# Altium schematic sheet Arduino_4_Layer.SchDoc
size A
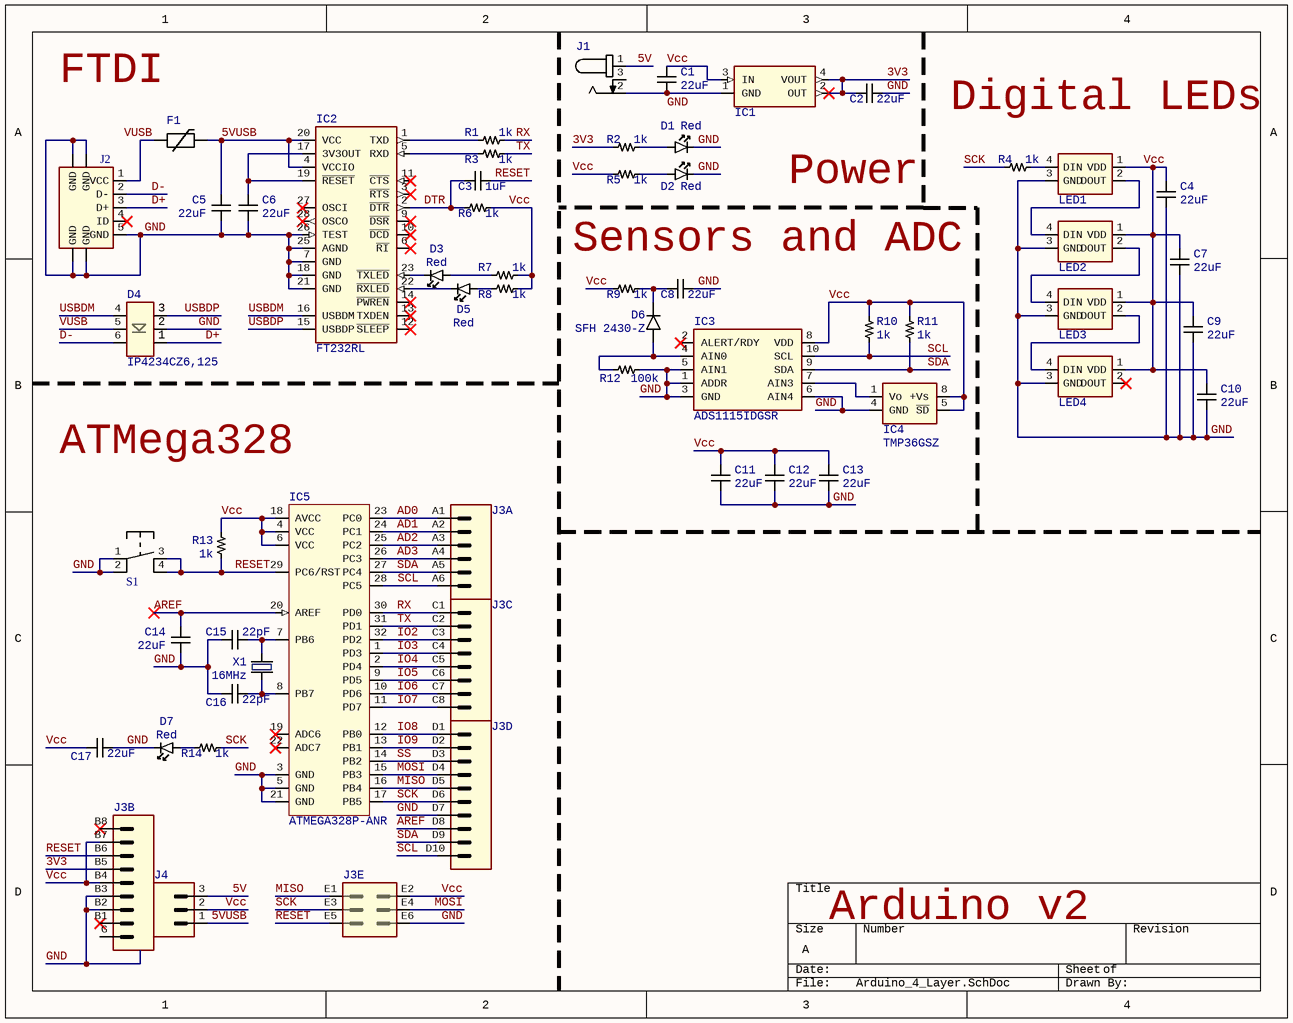
[diagram p0: Arduino_4_Layer.SchDoc]

## Parts
C1  22uF  [CAP1206]
C2  22uF  [CAP1206]
C3  1uF  [CAP1206]
C4  22uF  [CAP1206]
C5  22uF  [CAP1206]
C6  22uF  [CAP1206]
C7  22uF  [CAP1206]
C8  22uF  [CAP1206]
C9  22uF  [CAP1206]
C10  22uF  [CAP1206]
C11  22uF  [CAP1206]
C12  22uF  [CAP1206]
C13  22uF  [CAP1206]
C14  22uF  [CAP1206]
C15  22pF  [CAP1206]
C16  22pF  [CAP1206]
C17  22uF  [CAP1206]
D1  Red  [LED]
D2  Red  [LED]
D3  Red  [LED]
D4  IP4234CZ6,125  [TSOP-6]
D5  Red  [LED]
D6  SFH 2430-Z  [SFH 2430]
D7  Red  [LED]
F1  MF-MSMF050-2  [FUSE]  (value not drawn)
IC1  AZ1117CH-3.3TRG1  [SOT223]  (value not drawn)
IC2  FT232RL  [SOP65P780X200-28N]
IC3  ADS1115IDGSR  [VSSOP-10]
IC4  TMP36GSZ  [SOIC-8]
IC5  ATMEGA328P-ANR  [TQFP-32]
J1  Power Jack  [Power_Jack]  (value not drawn)
J2  XM7D-0512  [XM7D-0512]  (value not drawn)
J3  Arduino_Shield  [ARDUINO_SHIELD]  (value not drawn)  (parts A,B,C,D,E of 5)
J4  PREC003SAAN-RC  [3_PIN]  (value not drawn)
LED1  IN-PI55QATPRPGPBPW-60  [PLCC_5x5]  (value not drawn)
LED2  IN-PI55QATPRPGPBPW-60  [PLCC_5x5]  (value not drawn)
LED3  IN-PI55QATPRPGPBPW-60  [PLCC_5x5]  (value not drawn)
LED4  IN-PI55QATPRPGPBPW-60  [PLCC_5x5]  (value not drawn)
R1  1k  [RES1206]
R2  1k  [RES1206]
R3  1k  [RES1206]
R4  1k  [RES1206]
R5  1k  [RES1206]
R6  1k  [RES1206]
R7  1k  [RES1206]
R8  1k  [RES1206]
R9  1k  [RES1206]
R10  1k  [RES1206]
R11  1k  [RES1206]
R12  100k  [RES1206]
R13  1k  [RES1206]
R14  1k  [RES1206]
S1  TL3305AF160QG  [Switch]  (value not drawn)
X1  16MHz  [Crystal]

## Nets
3V3: C2.2 IC1.2(OUT) IC1.4(VOUT) J3.B5 R2.2
5V: J1.1 J4.3
5VUSB: C5.2 F1.2 IC2.4(VCCIO) IC2.20(VCC) J4.1
AD0: IC5.23(PC0) J3.A1
AD1: IC5.24(PC1) J3.A2
AD2: IC5.25(PC2) J3.A3
AD3: IC5.26(PC3) J3.A4
AREF: C14.2 IC5.20(AREF) J3.D8
D+: D4.1 J2.3(D+)
D-: D4.6 J2.2(D-)
DTR: C3.1 IC2.2(~{DTR}) R6.1
GND: C1.2 C2.1 C4.1 C5.1 C6.1 C7.1 C8.2 C9.1 C10.1 C11.1 C12.1 C13.1 C14.1 C15.1 C16.1 C17.1 D1.1 D2.1 D4.2 D7.1 IC1.1(GND) IC2.7(GND) IC2.18(GND) IC2.21(GND) IC2.25(AGND) IC2.26(TEST) IC3.1(ADDR) IC3.3(GND) IC3.5(AIN1) IC3.6(AIN4) IC4.4(GND) IC5.3(GND) IC5.5(GND) IC5.21(GND) J1.2 J2.5(GND) J2.SH1(GND) J2.SH2(GND) J2.SH3(GND) J2.SH4(GND) J3.B2 J3.B3 J3.D7 J3.E6 LED1.3(GND) LED2.3(GND) LED3.3(GND) LED4.3(GND) R12.1 S1.1 S1.2
IO2: IC5.32(PD2) J3.C3
IO3: IC5.1(PD3) J3.C4
IO4: IC5.2(PD4) J3.C5
IO5: IC5.9(PD5) J3.C6
IO6: IC5.10(PD6) J3.C7
IO7: IC5.11(PD7) J3.C8
IO8: IC5.12(PB0) J3.D1
IO9: IC5.13(PB1) J3.D2
MISO: IC5.16(PB4) J3.D5 J3.E1
MOSI: IC5.15(PB3) J3.D4 J3.E4
RESET: C3.2 IC5.29(PC6/RST) J3.B6 J3.E5 R13.1 S1.3 S1.4
RX: IC5.30(PD0) J3.C1 R1.2
SCK: IC5.17(PB5) J3.D6 J3.E3 R4.1 R14.2
SCL: IC3.10(SCL) IC5.28(PC5) J3.A6 J3.D10 R10.1
SDA: IC3.9(SDA) IC5.27(PC4) J3.A5 J3.D9 R11.1
SS: IC5.14(PB2) J3.D3
TX: IC5.31(PD1) J3.C2 R3.2
USBDM: D4.4 IC2.16(USBDM)
USBDP: D4.3 IC2.15(USBDP)
Vcc: C1.1 C4.2 C7.2 C9.2 C10.2 C11.2 C12.2 C13.2 C17.2 IC1.3(IN) IC3.8(VDD) IC4.5(~{SD}) IC4.8(+Vs) IC5.4(VCC) IC5.6(VCC) IC5.18(AVCC) J3.B4 J3.B7 J3.E2 J4.2 LED1.1(VDD) LED2.1(VDD) LED3.1(VDD) LED4.1(VDD) R5.2 R6.2 R7.2 R8.2 R9.2 R10.2 R11.2 R13.2
VUSB: D4.5 F1.1 J2.1(VCC)
NetC6_2: C6.2 IC2.17(3V3OUT) IC2.19(~{RESET})
NetC8_1: C8.1 D6.C R9.1
NetC15_2: C15.2 IC5.7(PB6) X1.2
NetC16_2: C16.2 IC5.8(PB7) X1.1
NetD1_2: D1.2 R2.1
NetD2_2: D2.2 R5.1
NetD3_1: D3.1 IC2.23(~{TXLED})
NetD3_2: D3.2 R7.1
NetD5_1: D5.1 IC2.22(~{RXLED})
NetD5_2: D5.2 R8.1
NetD6_A: D6.A IC3.4(AIN0) R12.2
NetD7_2: D7.2 R14.1
NetIC2_1: IC2.1(TXD) R1.1
NetIC2_5: IC2.5(RXD) R3.1
NetIC3_7: IC3.7(AIN3) IC4.1(Vo)
NetLED1_2: LED1.2(DOUT) LED2.4(DIN)
NetLED1_4: LED1.4(DIN) R4.2
NetLED2_2: LED2.2(DOUT) LED3.4(DIN)
NetLED3_2: LED3.2(DOUT) LED4.4(DIN)

Not connected (* = marked no-connect by the designer): IC2 3(~{RTS})* 6(~{RI})* 9(~{DSR})* 10(~{DCD})* 11(~{CTS})* 12(~{SLEEP})* 13(TXDEN)* 14(~{PWREN})* 27(OSCI)* 28(OSCO)*; IC3 2(ALERT/RDY)*; IC5 19(ADC6)* 22(ADC7)*; J1 3; J2 4(ID)*; J3 B1(1)* B8(8)* G(GND); LED4 2(DOUT)*

## Notes on the sheet
- FTDI
- Digital LEDs
- Power
- Sensors and ADC
- ATMega328
- Arduino v2

## Library data of the parts
C1 C2 C4-C14 C17 = 1206_22uF: 22µF ±20% 16V Ceramic Capacitor X5R 1206 (3216 Metric); Value: CAP CER 22UF 16V X5R 1206; Digikey Link: https://www.digikey.com/product-detail/en/CL31A226MOCLNNC/1276-2728-1-ND/3890814/?itemSeq=304982363; Digikey Part: 1276-2728-1-ND
C3 = 1206_1uF: 1µF ±20% 16V Ceramic Capacitor X7R 1206 (3216 Metric); Value: CAP CER 1UF 16V X7R 1206; Digikey Link: https://www.digikey.com/product-detail/en/C1206C105M4RACTU/399-8150-1-ND/3471873/?itemSeq=304982366; Digikey Part: 399-8150-1-ND
C15 C16 = 1206_22pF: 22pF ±5% 16V Ceramic Capacitor C0G, NP0 1206 (3216 Metric); Value: CAP CER 22PF 16V C0G/NP0 1206; Digikey Link: https://www.digikey.com/product-detail/en/885012008011/732-7867-1-ND/5454494/?itemSeq=304982362; Digikey Part: 732-7867-1-ND
D1-D3 D5 D7 = 1206_RED_LED: Red 638nm LED Indication - Discrete 1.8V 1206 (3216 Metric); Value: LED RED CLEAR 1206 SMD; Digikey Link: https://www.digikey.com/product-detail/en/LTST-C150CKT/160-1167-1-ND/269239/?itemSeq=304982368; Digikey Part: 160-1167-1-ND
D4 = TVS_Diode: Clamp Ipp Tvs Diode Surface Mount 6-TSOP; Value: TVS DIODE 5.5V 6TSOP; Digikey Part: 1727-4717-1-ND; Digikey Link: https://www.digikey.com/product-detail/en/IP4234CZ6%2c125/1727-4717-1-ND/2531156/?itemSeq=304982369
D6 = SFH 2430-Z: Ambient Light Sensor Photodiode Chip 570nm 0.17A/W Sensitivity Automotive 2-Pin DIL SMT; Manufacturer: Osram Opto; Rise Time: 200us; Dark Current: 100pA; Forward Voltage: 1.2V; Viewing Angle: 120°; Forward Current: 100mA; Reverse Voltage (DC): 6V; Max Power Dissipation: 150mW; Diode Type: PIN; Supplier 1: Digi-Key; Manufacturer Part Number: SFH 2430-Z; Stock 1: 19614; Pricing 1: 1=1.86000, 10=1.51200, 100=0.93020, 500=0.79066 (USD); Mount: Surface Mount; Case/Package: SMD/SMT; Number of Pins: 2; Min Operating Temperature: -40°C; Max Operating Temperature: 100°C; Wavelength: 570nm; Fall Time: 200us; Package Quantity: 1500; Packaging: Tape and Reel; Response Time: 200us; Max Reverse Voltage (DC): 6V; Length: 4.5mm; Height: 1.2mm; Width: 4mm; Radiation Hardening: No; ComponentLink1URL: https://datasheet.ciiva.com/1249/00049208-0-1249200.pdf?src-supplier=Avnet; ComponentLink1Description: https://datasheet.ciiva.com/1249/00049208-0-1249200.pdf?src-supplier=Avnet; ComponentLink2URL: https://datasheet.ciiva.com/4697/fh2430-pb-free-2011-10-14-57278-4697621.pdf?src-supplier=Mouser; ComponentLink2Description: https://datasheet.ciiva.com/4697/fh2430-pb-free-2011-10-14-57278-4697621.pdf?src-supplier=Mouser; ComponentLink3URL: https://datasheet.ciiva.com/15117/getdatasheetpartid-572445-15117163.pdf?src-supplier=Verical; ComponentLink3Description: https://datasheet.ciiva.com/15117/getdatasheetpartid-572445-15117163.pdf?src-supplier=Verical; ComponentLink4URL: https://datasheet.ciiva.com/2819/00083291-0-2819841.pdf?src-supplier=Digi-Key; ComponentLink4Description: https://datasheet.ciiva.com/2819/00083291-0-2819841.pdf?src-supplier=Digi-Key; ComponentLink5URL: https://datasheet.ciiva.com/2819/00083291-0-2819842.pdf?src-supplier=Digi-Key; ComponentLink5Description: https://datasheet.ciiva.com/2819/00083291-0-2819842.pdf?src-supplier=Digi-Key; ComponentLink6URL: https://datasheet.ciiva.com/2819/00083291-0-2819843.pdf?src-supplier=Digi-Key; ComponentLink6Description: https://datasheet.ciiva.com/2819/00083291-0-2819843.pdf?src-supplier=Digi-Key; ComponentLink7URL: http://datasheet.octopart.com/Q65110-A2673-Osram-datasheet-13705788.pdf?src-supplier=_legacy+Avnet; ComponentLink7Description: http://datasheet.octopart.com/Q65110-A2673-Osram-datasheet-13705788.pdf?src-supplier=_legacy+Avnet
F1 = Fuse: Polymeric PTC Resettable Fuse 15V 500mA Ih Surface Mount 1812 (4532 Metric), Concave; Value: PTC RESET FUSE 15V 500MA 1812; Digikey Link: https://www.digikey.com/product-detail/en/MF-MSMF050-2/MF-MSMF050-2CT-ND/662842/?itemSeq=304982360; Digikey Part: MF-MSMF050-2CT-ND
IC1 = 3.3V_LDO: Linear Voltage Regulator IC Positive Fixed 1 Output 1A SOT-223; Value: IC REG LINEAR 3.3V 800MA SOT223; Digikey Link: https://www.digikey.com/product-detail/en/AZ1117CH-3.3TRG1/AZ1117CH-3.3TRG1DICT-ND/4505206/?itemSeq=304982370; Digikey Part: AZ1117CH-3.3TRG1DICT-ND
IC2 = FTDI: USB Bridge, USB to UART USB 2.0 UART Interface 28-SSOP; Value: IC USB FS SERIAL UART 28-SSOP; Digikey Part: 768-1007-1-ND; Digikey Link: https://www.digikey.com/product-detail/en/FT232RL-REEL/768-1007-1-ND/1836402/?itemSeq=304982359
IC3 = ADS1115IDGSR: 4-Channel Single ADC Delta-Sigma 860sps 16-bit Serial 10-Pin VSSOP T/R; Manufacturer: Texas Instruments; Interface: I2C; Number of Bits: 16; Sampling Rate: 860S/s; Number of A/D Converters: 1; Resolution: 16b; Polarity: Bipolar; Min Supply Voltage: 2V; Max Supply Voltage: 5.5V; Conversion Rate: 0.86KS/s; Number of Inputs: 4; Integral Nonlinearity (INL): 1LSB; Power Dissipation: 900uW; Supplier 1: Digi-Key; Manufacturer Part Number: ADS1115IDGSR; Stock 1: 14647; Pricing 1: 1=5.52000, 10=4.96200, 100=3.85670, 500=3.33556, 1000=2.77268 (USD); Case/Package: VSSOP; Number of Pins: 10; Contact Plating: Gold; Min Operating Temperature: -40°C; Max Operating Temperature: 125°C; Package Quantity: 2500; Packaging: Tape and Reel; Number of Converters: 1; Supply Type: Single; Max Supply Voltage (DC): 5.5V; Min Supply Voltage (DC): 2V; Radiation Hardening: No; REACH SVHC: No SVHC; Lead Free: Lead Free; ComponentLink1URL: https://datasheet.ciiva.com/4031/47725463s8438921n7713-4031028.pdf?src-supplier=Arrow; ComponentLink1Description: https://datasheet.ciiva.com/4031/47725463s8438921n7713-4031028.pdf?src-supplier=Arrow; ComponentLink2URL: https://datasheet.ciiva.com/1304/ads1113-1304266.pdf?src-supplier=Digi-Key; ComponentLink2Description: https://datasheet.ciiva.com/1304/ads1113-1304266.pdf?src-supplier=Digi-Key; ComponentLink3URL: https://datasheet.ciiva.com/25993/sbas444b-25993205.pdf?src-supplier=Avnet+Europe; ComponentLink3Description: https://datasheet.ciiva.com/25993/sbas444b-25993205.pdf?src-supplier=Avnet+Europe; ComponentLink4URL: https://octopart.com/click/track?ai=2118&ct=datasheets&sig=0bc4b7d&at=physicalpart&sid=370&ppid=12194578&hlid=24870511&src-supplier=TI+store; ComponentLink4Description: https://octopart.com/click/track?ai=2118&ct=datasheets&sig=0bc4b7d&at=physicalpart&sid=370&ppid=12194578&hlid=24870511&src-supplier=TI+store; ComponentLink5URL: http://datasheet.octopart.com/ADS1115IDGSR-Texas-Instruments-datasheet-21818186.pdf?src-supplier=Newark; ComponentLink5Description: http://datasheet.octopart.com/ADS1115IDGSR-Texas-Instruments-datasheet-21818186.pdf?src-supplier=Newark; ComponentLink6URL: http://datasheet.octopart.com/ADS1115IDGSR-Texas-Instruments-datasheet-10258908.pdf?src-supplier=TI+store; ComponentLink6Description: http://datasheet.octopart.com/ADS1115IDGSR-Texas-Instruments-datasheet-10258908.pdf?src-supplier=TI+store; ComponentLink7URL: http://datasheet.octopart.com/ADS1115IDGSR-Texas-Instruments-datasheet-10254488.pdf?src-supplier=TI+store; ComponentLink7Description: http://datasheet.octopart.com/ADS1115IDGSR-Texas-Instruments-datasheet-10254488.pdf?src-supplier=TI+store; ComponentLink8URL: http://sigma.octopart.com/49250172/technical_drawing/Texas-Instruments-ADS1115IDGSR.pdf?src-supplier=TI+store; ComponentLink8Description: http://sigma.octopart.com/49250172/technical_drawing/Texas-Instruments-ADS1115IDGSR.pdf?src-supplier=TI+store; ComponentLink9URL: http://datasheet.octopart.com/ADS1115IDGSR-Texas-Instruments-datasheet-14070808.pdf?src-supplier=IIIC; ComponentLink9Description: http://datasheet.octopart.com/ADS1115IDGSR-Texas-Instruments-datasheet-14070808.pdf?src-supplier=IIIC; ComponentLink10URL: http://datasheet.octopart.com/ADS1115IDGSR-Texas-Instruments-datasheet-78774318.pdf?src-supplier=Farnell; ComponentLink10Description: http://datasheet.octopart.com/ADS1115IDGSR-Texas-Instruments-datasheet-78774318.pdf?src-supplier=Farnell
IC4 = TMP36GSZ: Temp Sensor Analog(Voltage) Serial (2-Wire) 8-Pin SOIC N Tube; Manufacturer: Analog Devices; Min Supply Voltage: 2.7V; Max Supply Voltage: 5.5V; Operating Supply Current: 50uA; Output Current: 50A; Supplier 1: Digi-Key; Manufacturer Part Number: TMP36GSZ; Stock 1: 1242; Pricing 1: 1=1.48000, 10=1.32500, 25=1.25000, 100=1.06500, 500=0.87500, 1000=0.72500, 5000=0.70000 (USD); Case/Package: R; Number of Pins: 8; Min Operating Temperature: -40°C; Max Operating Temperature: 125°C; Package Quantity: 98; Interface: Analog; Packaging: Rail/Tube; Nominal Supply Current: 50uA; Output Type: Analog; Termination: SMD/SMT; Quiescent Current: 50uA; Length: 5mm; Height: 1.5mm; Width: 4mm; Radiation Hardening: No; Lead Free: Contains Lead; REACH SVHC: No SVHC; ComponentLink1URL: https://datasheet.ciiva.com/15098/getdatasheetpartid-116076-15098223.pdf?src-supplier=Verical; ComponentLink1Description: https://datasheet.ciiva.com/15098/getdatasheetpartid-116076-15098223.pdf?src-supplier=Verical; ComponentLink2URL: https://datasheet.ciiva.com/1514/1793789-1514118.pdf?src-supplier=Element14; ComponentLink2Description: https://datasheet.ciiva.com/1514/1793789-1514118.pdf?src-supplier=Element14; ComponentLink3URL: https://datasheet.ciiva.com/3278/tmp35-36-37-3278025.pdf?src-supplier=Avnet; ComponentLink3Description: https://datasheet.ciiva.com/3278/tmp35-36-37-3278025.pdf?src-supplier=Avnet; ComponentLink4URL: https://datasheet.ciiva.com/7992/1793789-7992346.pdf?src-supplier=Element14; ComponentLink4Description: https://datasheet.ciiva.com/7992/1793789-7992346.pdf?src-supplier=Element14; ComponentLink5URL: https://datasheet.ciiva.com/16219/tmp35-36-37-246343-16219643.pdf?src-supplier=Mouser; ComponentLink5Description: https://datasheet.ciiva.com/16219/tmp35-36-37-246343-16219643.pdf?src-supplier=Mouser; ComponentLink6URL: https://datasheet.ciiva.com/16636/tmp35-36-37-16636046.pdf?src-supplier=Avnet+Europe; ComponentLink6Description: https://datasheet.ciiva.com/16636/tmp35-36-37-16636046.pdf?src-supplier=Avnet+Europe; ComponentLink7URL: https://datasheet.ciiva.com/2847/tmp35-36-37-2847519.pdf?src-supplier=Digi-Key; ComponentLink7Description: https://datasheet.ciiva.com/2847/tmp35-36-37-2847519.pdf?src-supplier=Digi-Key; ComponentLink8URL: http://datasheet.octopart.com/TMP36GSZ-Analog-Devices-datasheet-5402947.pdf?src-supplier=Newark; ComponentLink8Description: http://datasheet.octopart.com/TMP36GSZ-Analog-Devices-datasheet-5402947.pdf?src-supplier=Newark; ComponentLink9URL: http://datasheet.octopart.com/TMP36GSZ-Analog-Devices-datasheet-10538785.pdf?src-supplier=Newark; ComponentLink9Description: http://datasheet.octopart.com/TMP36GSZ-Analog-Devices-datasheet-10538785.pdf?src-supplier=Newark; ComponentLink10URL: http://datasheet.octopart.com/TMP36GSZ-Analog-Devices-datasheet-22148775.pdf?src-supplier=Newark; ComponentLink10Description: http://datasheet.octopart.com/TMP36GSZ-Analog-Devices-datasheet-22148775.pdf?src-supplier=Newark; ComponentLink11URL: http://datasheet.octopart.com/TMP36GSZ-Analog-Devices-datasheet-43345165.pdf?src-supplier=Farnell; ComponentLink11Description: http://datasheet.octopart.com/TMP36GSZ-Analog-Devices-datasheet-43345165.pdf?src-supplier=Farnell; ComponentLink12URL: http://datasheet.octopart.com/TMP36GSZ-Analog-Devices-datasheet-120101.pdf?src-supplier=Digi-Key; ComponentLink12Description: http://datasheet.octopart.com/TMP36GSZ-Analog-Devices-datasheet-120101.pdf?src-supplier=Digi-Key; ComponentLink13URL: http://datasheet.octopart.com/TMP36GSZ-Analog-Devices-datasheet-14184915.pdf?src-supplier=IIIC; ComponentLink13Description: http://datasheet.octopart.com/TMP36GSZ-Analog-Devices-datasheet-14184915.pdf?src-supplier=IIIC
IC5 = ATMega328P: AVR AVR® ATmega Microcontroller IC 8-Bit 20MHz 32KB (16K x 16) FLASH 32-TQFP (7x7); Value: IC MCU 8BIT 32KB FLASH 32TQFP; Digikey Link: https://www.digikey.com/product-detail/en/ATMEGA328P-ANR/ATMEGA328P-ANRCT-ND/2774230/?itemSeq=304982365; Digikey Part: ATMEGA328P-ANRCT-ND
J1 = Power Jack: Power Barrel Connector Jack 2.10mm ID (0.083"), 5.50mm OD (0.217") Through Hole, Right Angle; Value: CONN PWR JACK 2X5.5MM SOLDER; Digikey Link: https://www.digikey.com/product-detail/en/PJ-102A/CP-102A-ND/275425/?itemSeq=304982367; Digikey Part: CP-102A-ND
J2 = USB: USB - mini B USB 2.0 Receptacle Connector 5 Position Through Hole, Right Angle; Value: CONN RCPT USB2.0 MINI B 5P R/A; Digikey Link: https://www.digikey.com/product-detail/en/XM7D-0512/OR1205-ND/4695531/?itemSeq=304982356; Digikey Part: OR1205-ND
J4 = 3_PIN: Connector Header Through Hole 3 position 0.100" (2.54mm); Value: CONN HEADER VERT 3POS 2.54MM; Digikey Link: https://www.digikey.com/product-detail/en/PREC003SAAN-RC/S1012EC-03-ND/2774851/?itemSeq=304982371; Digikey Part: S1012EC-03-ND
LED1-LED4 = IN-PI55QATPRPGPBPW-60: Top View Plcc 5.0X5.0X1.6 4-PIN; Manufacturer: Inolux; Supplier 1: Digi-Key; Manufacturer Part Number: IN-PI55QATPRPGPBPW-60; Stock 1: 231; Pricing 1: 1=0.76000, 10=0.59400, 100=0.38160, 500=0.32224 (USD)
R1-R11 R13 R14 = 1206_1K: 1 kOhms ±1% 0.5W, 1/2W Chip Resistor 1206 (3216 Metric) Anti-Sulfur, Moisture Resistant Thin Film; Value: RES 1K OHM 1% 1/2W 1206; Digikey Link: https://www.digikey.com/product-detail/en/RNCP1206FTD1K00/RNCP1206FTD1K00CT-ND/2240675/?itemSeq=304982373; Digikey Part: RNCP1206FTD1K00CT-ND
R12 = 1206_100k: 100 kOhms ±5% 0.25W, 1/4W Chip Resistor 1206 (3216 Metric) Automotive AEC-Q200 Thick Film
S1 = Push_Button: Tactile Switch SPST-NO Top Actuated Surface Mount; Value: SWITCH TACTILE SPST-NO 50MA 12V; Digikey Link: https://www.digikey.com/product-detail/en/TL3305AF160QG/EG5350CT-ND/5816195/?itemSeq=304982361; Digikey Part: EG5350CT-ND
X1 = 16MHz_Crystal: 16MHz ±30ppm Crystal 18pF 40 Ohms HC-49/US; Value: CRYSTAL 16.0000MHZ 18PF SMD; Digikey Link: https://www.digikey.com/product-detail/en/ABLS-16.000MHZ-B4-T/535-10226-1-ND/2184261/?itemSeq=304982364; Digikey Part: 535-10226-1-ND